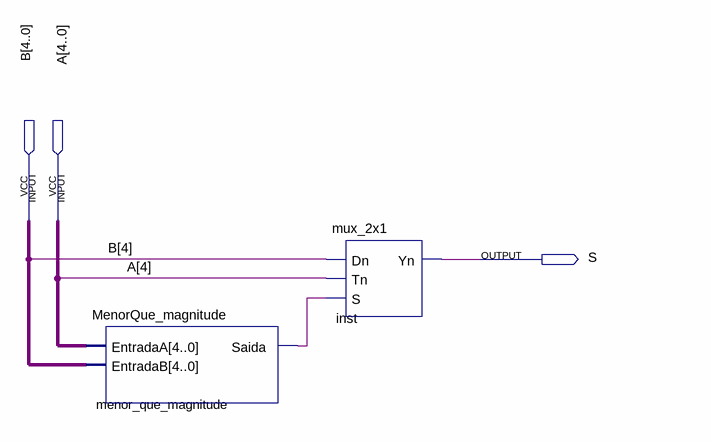
[diagram p0: schematic sheet]
// Quartus schematic teste_sinal_subtrator.bdf as structural Verilog: 2 symbols, 3 pins
module teste_sinal_subtrator (
  input  [4:0] B,
  input  [4:0] A,
  output S
);

  wire menor_que_magnitude_saida;

  MenorQue_magnitude menor_que_magnitude (.EntradaA(A), .EntradaB(B), .Saida(menor_que_magnitude_saida));
  mux_2x1 inst (.Dn(B[4]), .Tn(A[4]), .S(menor_que_magnitude_saida), .Yn(S));
endmodule
